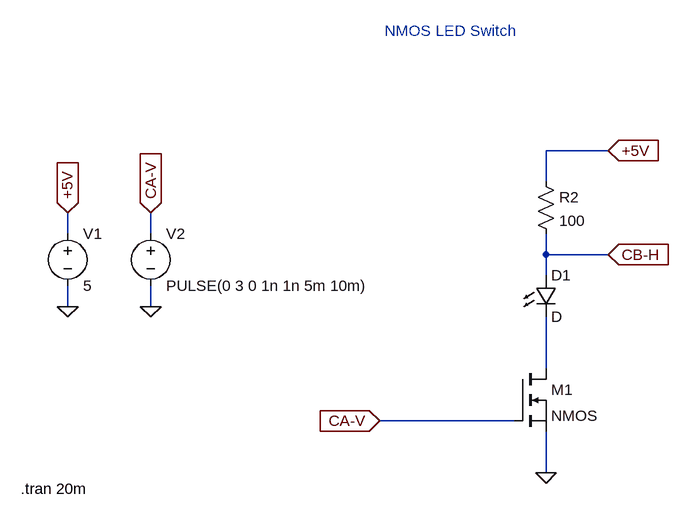
[diagram p0: schematic nmos_led_switch_ltpice.asc]
nmos_led_switch_ltpice.asc, the LTspice schematic file:
Version 4
SHEET 1 880 680
WIRE 368 -224 272 -224
WIRE 272 -176 272 -224
WIRE -464 -96 -464 -128
WIRE -336 -96 -336 -128
WIRE 272 -64 272 -96
WIRE 368 -64 272 -64
WIRE 272 -32 272 -64
WIRE -464 16 -464 -16
WIRE -336 16 -336 -16
WIRE 272 112 272 32
WIRE 224 192 16 192
WIRE 272 272 272 208
FLAG 272 272 0
FLAG 368 -224 +5V
IOPIN 368 -224 In
FLAG 368 -64 CB-H
IOPIN 368 -64 In
FLAG 16 192 CA-V
IOPIN 16 192 In
FLAG -464 16 0
FLAG -336 16 0
FLAG -464 -128 +5V
IOPIN -464 -128 In
FLAG -336 -128 CA-V
IOPIN -336 -128 In
SYMBOL LED 256 -32 R0
SYMATTR InstName D1
SYMBOL res 256 -192 R0
SYMATTR InstName R2
SYMATTR Value 100
SYMBOL voltage -464 -112 R0
WINDOW 123 0 0 Left 0
WINDOW 39 0 0 Left 0
SYMATTR InstName V1
SYMATTR Value 5
SYMBOL voltage -336 -112 R0
WINDOW 123 0 0 Left 0
WINDOW 39 0 0 Left 0
SYMATTR InstName V2
SYMATTR Value PULSE(0 3 0 1n 1n 5m 10m)
SYMBOL nmos 224 112 R0
SYMATTR InstName M1
TEXT -536 296 Left 2 !.tran 20m
TEXT 24 -408 Left 2 ;NMOS LED Switch

The netlist it stands for:
* nmos_led_switch_ltpice.asc
D1 CB-H N001 D
R2 +5V CB-H 100
V1 +5V 0 5
V2 CA-V 0 PULSE(0 3 0 1n 1n 5m 10m)
M1 N001 CA-V 0 0 NMOS
.model D D
.lib standard.dio
.model NMOS NMOS
.model PMOS PMOS
.lib standard.mos
.tran 20m
* NMOS LED Switch
.backanno
.end